# Altium schematic sheet Sheet1.SchDoc
size A4; SheetNumber: 1; SheetTotal: 1
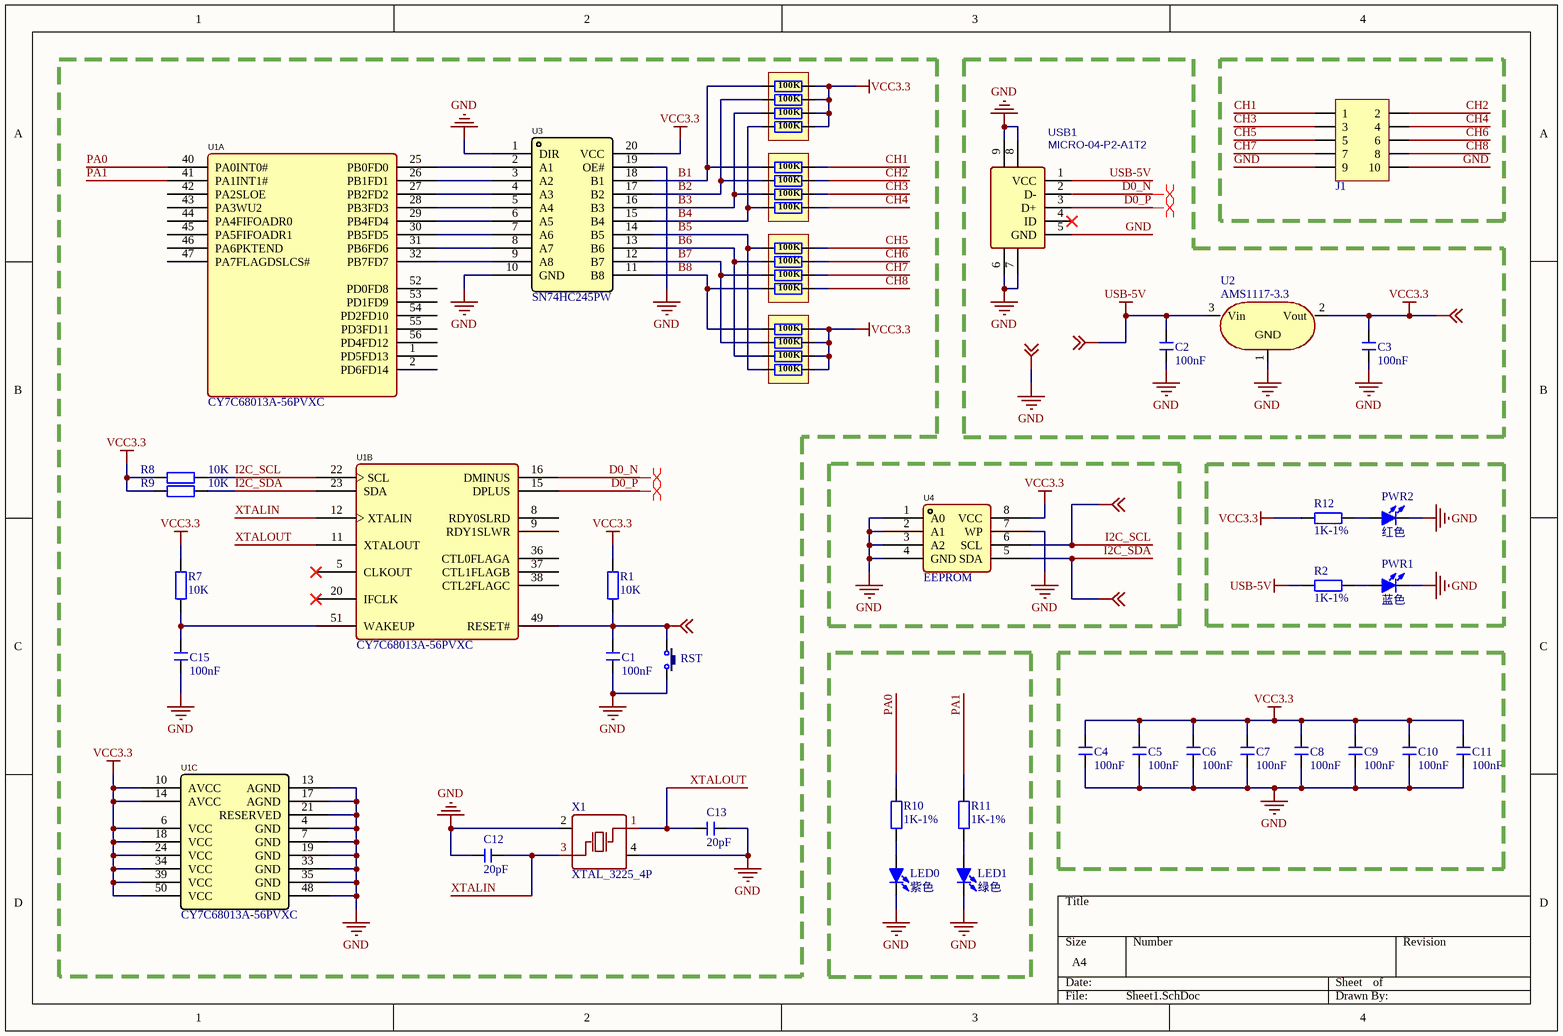
[diagram p0: Sheet1.SchDoc]

## Parts
C1  100nF  [C 0603_L]
C2  100nF  [C 0603_L]
C3  100nF  [C 0603_L]
C4  100nF  [C 0603_L]
C5  100nF  [C 0603_L]
C6  100nF  [C 0603_L]
C7  100nF  [C 0603_L]
C8  100nF  [C 0603_L]
C9  100nF  [C 0603_L]
C10  100nF  [C 0603_L]
C11  100nF  [C 0603_L]
C12  20pF  [C 0603_L]
C13  20pF  [C 0603_L]
C15  100nF  [C 0603_L]
J1  Header 5X2  [HDR2.54-2x5P_xxx]  (value not drawn)
LED0  紫色  [LED 0603B]
LED1  绿色  [LED 0603G]
PWR1  蓝色  [LED 0603B]
PWR2  红色  [LED 0603R]
R1  10K  [R 0603_L]
R2  1K-1%  [R 0603_L]
R3  100k  [RCA-8P4R-0402]  (value not drawn)
R4  100k  [RCA-8P4R-0402]  (value not drawn)
R5  100k  [RCA-8P4R-0402]  (value not drawn)
R6  100k  [RCA-8P4R-0402]  (value not drawn)
R7  10K  [R 0603_L]
R8  10K  [R 0603_L]
R9  10K  [R 0603_L]
R10  1K-1%  [R 0603_L]
R11  1K-1%  [R 0603_L]
R12  1K-1%  [R 0603_L]
RST  KEY_SMD  [KEY_SMD - duplicate1]  (value not drawn)
T1  测试点  [测试点_2MM]  (value not drawn)
T2  测试点  [测试点_2MM]  (value not drawn)
T3  测试点  [测试点_2MM]  (value not drawn)
T4  测试点  [测试点_2MM]  (value not drawn)
T5  测试点  [测试点_3MM]  (value not drawn)
T6  测试点  [测试点_1MM]  (value not drawn)
U1  CY7C68013A-56PVXC  [CY7C68013A-56PVXC]  (parts A,B,C of 3)
U2  AMS1117-3.3  [SOT223_L]
U3  SN74HC245PW  [TSSOP-20]
U4  EEPROM  [SOP8_L]
USB1  MICRO-04-P2-A1T2  [MICRO-04-P2-A1T2]
X1  XTAL_3225_4P  [OSC 3225-4P]

## Nets
GND: C1.2 C2.2 C3.2 C4.1 C5.1 C6.1 C7.1 C8.1 C9.1 C10.1 C11.1 C12.1 C13.1 C15.2 J1.9 J1.10 LED0.2(K) LED1.2(K) PWR1.2(K) PWR2.2(K) RST.2 T5.0 U1.4(GND) U1.7(GND) U1.13(AGND) U1.17(AGND) U1.19(GND) U1.21(RESERVED) U1.33(GND) U1.35(GND) U1.48(GND) U2.1(GND) U3.1(DIR) U3.10(GND) U3.19(OE#) U4.1(A0) U4.2(A1) U4.3(A2) U4.4(GND) U4.7(WP) USB1.5(GND) USB1.6 USB1.7 USB1.8 USB1.9 X1.2(GND) X1.4(GND)
USB-5V: C2.1 R2.2 T2.0 U2.3(Vin) USB1.1(VCC)
VCC3.3: C3.1 C4.2 C5.2 C6.2 C7.2 C8.2 C9.2 C10.2 C11.2 R1.2 R3.5 R3.6 R3.7 R3.8 R6.5 R6.6 R6.7 R6.8 R7.2 R8.2 R9.2 R12.2 T1.0 U1.6(VCC) U1.10(AVCC) U1.14(AVCC) U1.18(VCC) U1.24(VCC) U1.34(VCC) U1.39(VCC) U1.50(VCC) U2.2(Vout) U3.20(VCC) U4.8(VCC)
B1: R3.1 R4.1 U3.18(B1)
B2: R3.2 R4.2 U3.17(B2)
B3: R3.3 R4.3 U3.16(B3)
B4: R3.4 R4.4 U3.15(B4)
B5: R5.1 R6.4 U3.14(B5)
B6: R5.2 R6.3 U3.13(B6)
B7: R5.3 R6.2 U3.12(B7)
B8: R5.4 R6.1 U3.11(B8)
CH1: J1.1 R4.8
CH2: J1.2 R4.7
CH3: J1.3 R4.6
CH4: J1.4 R4.5
CH5: J1.5 R5.8
CH6: J1.6 R5.7
CH7: J1.7 R5.6
CH8: J1.8 R5.5
D0_N: U1.16(DMINUS) USB1.2(D-)
D0_P: U1.15(DPLUS) USB1.3(D+)
I2C_SCL: R8.1 T3.0 U1.22(SCL) U4.6(SCL)
I2C_SDA: R9.1 T4.0 U1.23(SDA) U4.5(SDA)
PA0: R10.2 U1.40(PA0INT0#)
PA1: R11.2 U1.41(PA1INT1#)
XTALIN: C12.2 U1.12(XTALIN) X1.3(OSC2)
XTALOUT: C13.2 U1.11(XTALOUT) X1.1(OSC1)
NetC1_1: C1.1 R1.1 RST.1 T6.0 U1.49(RESET#)
NetC15_1: C15.1 R7.1 U1.51(WAKEUP)
NetLED0_1: LED0.1(A) R10.1
NetLED1_1: LED1.1(A) R11.1
NetPWR1_1: PWR1.1(A) R2.1
NetPWR2_1: PWR2.1(A) R12.1
NetU1_25: U1.25(PB0FD0) U3.2(A1)
NetU1_26: U1.26(PB1FD1) U3.3(A2)
NetU1_27: U1.27(PB2FD2) U3.4(A3)
NetU1_28: U1.28(PB3FD3) U3.5(A4)
NetU1_29: U1.29(PB4FD4) U3.6(A5)
NetU1_30: U1.30(PB5FD5) U3.7(A6)
NetU1_31: U1.31(PB6FD6) U3.8(A7)
NetU1_32: U1.32(PB7FD7) U3.9(A8)

Not connected (* = marked no-connect by the designer): U1 1(PD5FD13) 2(PD6FD14) 3(PD7FD15) 5(CLKOUT)* 8(RDY0SLRD) 9(RDY1SLWR) 20(IFCLK)* 36(CTL0FLAGA) 37(CTL1FLAGB) 38(CTL2FLAGC) 42(PA2SLOE) 43(PA3WU2) 44(PA4FIFOADR0) 45(PA5FIFOADR1) 46(PA6PKTEND) 47(PA7FLAGDSLCS#) 52(PD0FD8) 53(PD1FD9) 54(PD2FD10) 55(PD3FD11) 56(PD4FD12); USB1 4(ID)*

## Layout directives
differential pair: D0_N, D0_P

## Notes on the sheet
- (near R3) 100K
- (near R4) 100K
- (near R5) 100K
- (near R6) 100K

## Library data of the parts
C1-C13 C15 = C: 无极性贴片电容; 版权归属: 源创客; BOM名称: 无极性贴片电容; 学习资源: www.ooocke.com
J1 = Header 5X2: 5*2P接插件; 版权归属: 源创客; BOM名称: 5*2P接插件; 学习资源: www.ooocke.com
LED0 LED1 PWR1 PWR2 = LED-SMD: 贴片LED; 版权归属: 源创客; BOM名称: 贴片LED; 学习资源: www.ooocke.com
R1 R2 R7-R12 = R: 贴片电阻; 版权归属: 源创客; BOM名称: 贴片电阻; 学习资源: www.ooocke.com
R3-R6 = R-8P4R: 贴片网络排阻; 版权归属: 源创客; BOM名称: 贴片网络排阻; 学习资源: www.ooocke.com
U1 = CY7C68013A-56PVXC: Manufacturer: CYPRESS(赛普拉斯); Add into BOM: yes; Core Size: 8-Bit; Program Memory Type: ROMless; Core Processor: 8051; Speed: 48MHz; Voltage - Supply (Vcc/Vdd): 3.3V ~ 5V; RAM Size: 16KB; Number of I/O: 24; A/D: 0; UART/USART: 2; I2C（SMBUS/PMBUS）: 1; Name: CY7C68013A-56PVXC; Symbol: CY7C68013A-56PVXC; Device: CY7C68013A-56PVXC; LCSC Part Name: CY7C68013A-56PVXC; Supplier Part: C26717; Manufacturer Part: CY7C68013A-56PVXC; Supplier Footprint: SSOP-56_300mil; JLCPCB Part Class: Extended Part; Datasheet: https://atta.szlcsc.com/upload/public/pdf/source/20140224/1457706971052.pdf; Supplier: LCSC; Convert to PCB: yes; Program Memory Size: -; EEPROM Size: -; D/A: 0; PWM: 0; LCD: 0; SPI: 0; USB Device: -; USB Host/OTG: -; CAN: 0; Ethernet: 0; Features: -
U2 = AMS1117-3.3_C880752: LDO
U3 = SN74HC245NSR: 收发器; Manufacturer: TI(德州仪器); Add into BOM: yes; Name: SN74HC245NSR; Symbol: SN74HC245NSR; Device: SN74HC245NSR; LCSC Part Name: SN74HC245NSR; Supplier Part: C88578; Manufacturer Part: SN74HC245NSR; Supplier Footprint: SOP-20; JLCPCB Part Class: Extended Part; Datasheet: https://atta.szlcsc.com/upload/public/pdf/source/20170606/1496716522495.pdf; Supplier: LCSC; Convert to PCB: yes
U4 = AT24C02: LC_C688857; Manufacturer: IDCHIP(英锐芯); Device: AT24C02_C688857; Add into BOM: yes; Name: AT24C02; Symbol: AT24C02; LCSC Part Name: AT24C02; Supplier Part: C688857; Manufacturer Part: AT24C02; Supplier Footprint: SOP-8; JLCPCB Part Class: Extended Part; Datasheet: https://atta.szlcsc.com/upload/public/pdf/source/20200619/C688857_168265888F77B455D6D4136881F4BB15.pdf; Supplier: LCSC; Convert to PCB: yes
USB1 = MICRO-04-P2-A1T2: BOM_Manufacturer: Yuandi; Contributor: LCSC; BOM_Supplier: LCSC; BOM_Supplier Part: C2682532; BOM_Manufacturer Part: MICRO-04-P2-A1T2; BOM_JLCPCB Part Class: Extended Part; spicePre: U; spiceSymbolName: MICRO-04-P2-A1T2
X1 = XTAL: 24MHz